# EAGLE schematic LAB_20200315_1_UseFlexSensorToTestServo (EAGLE 9.3.2)
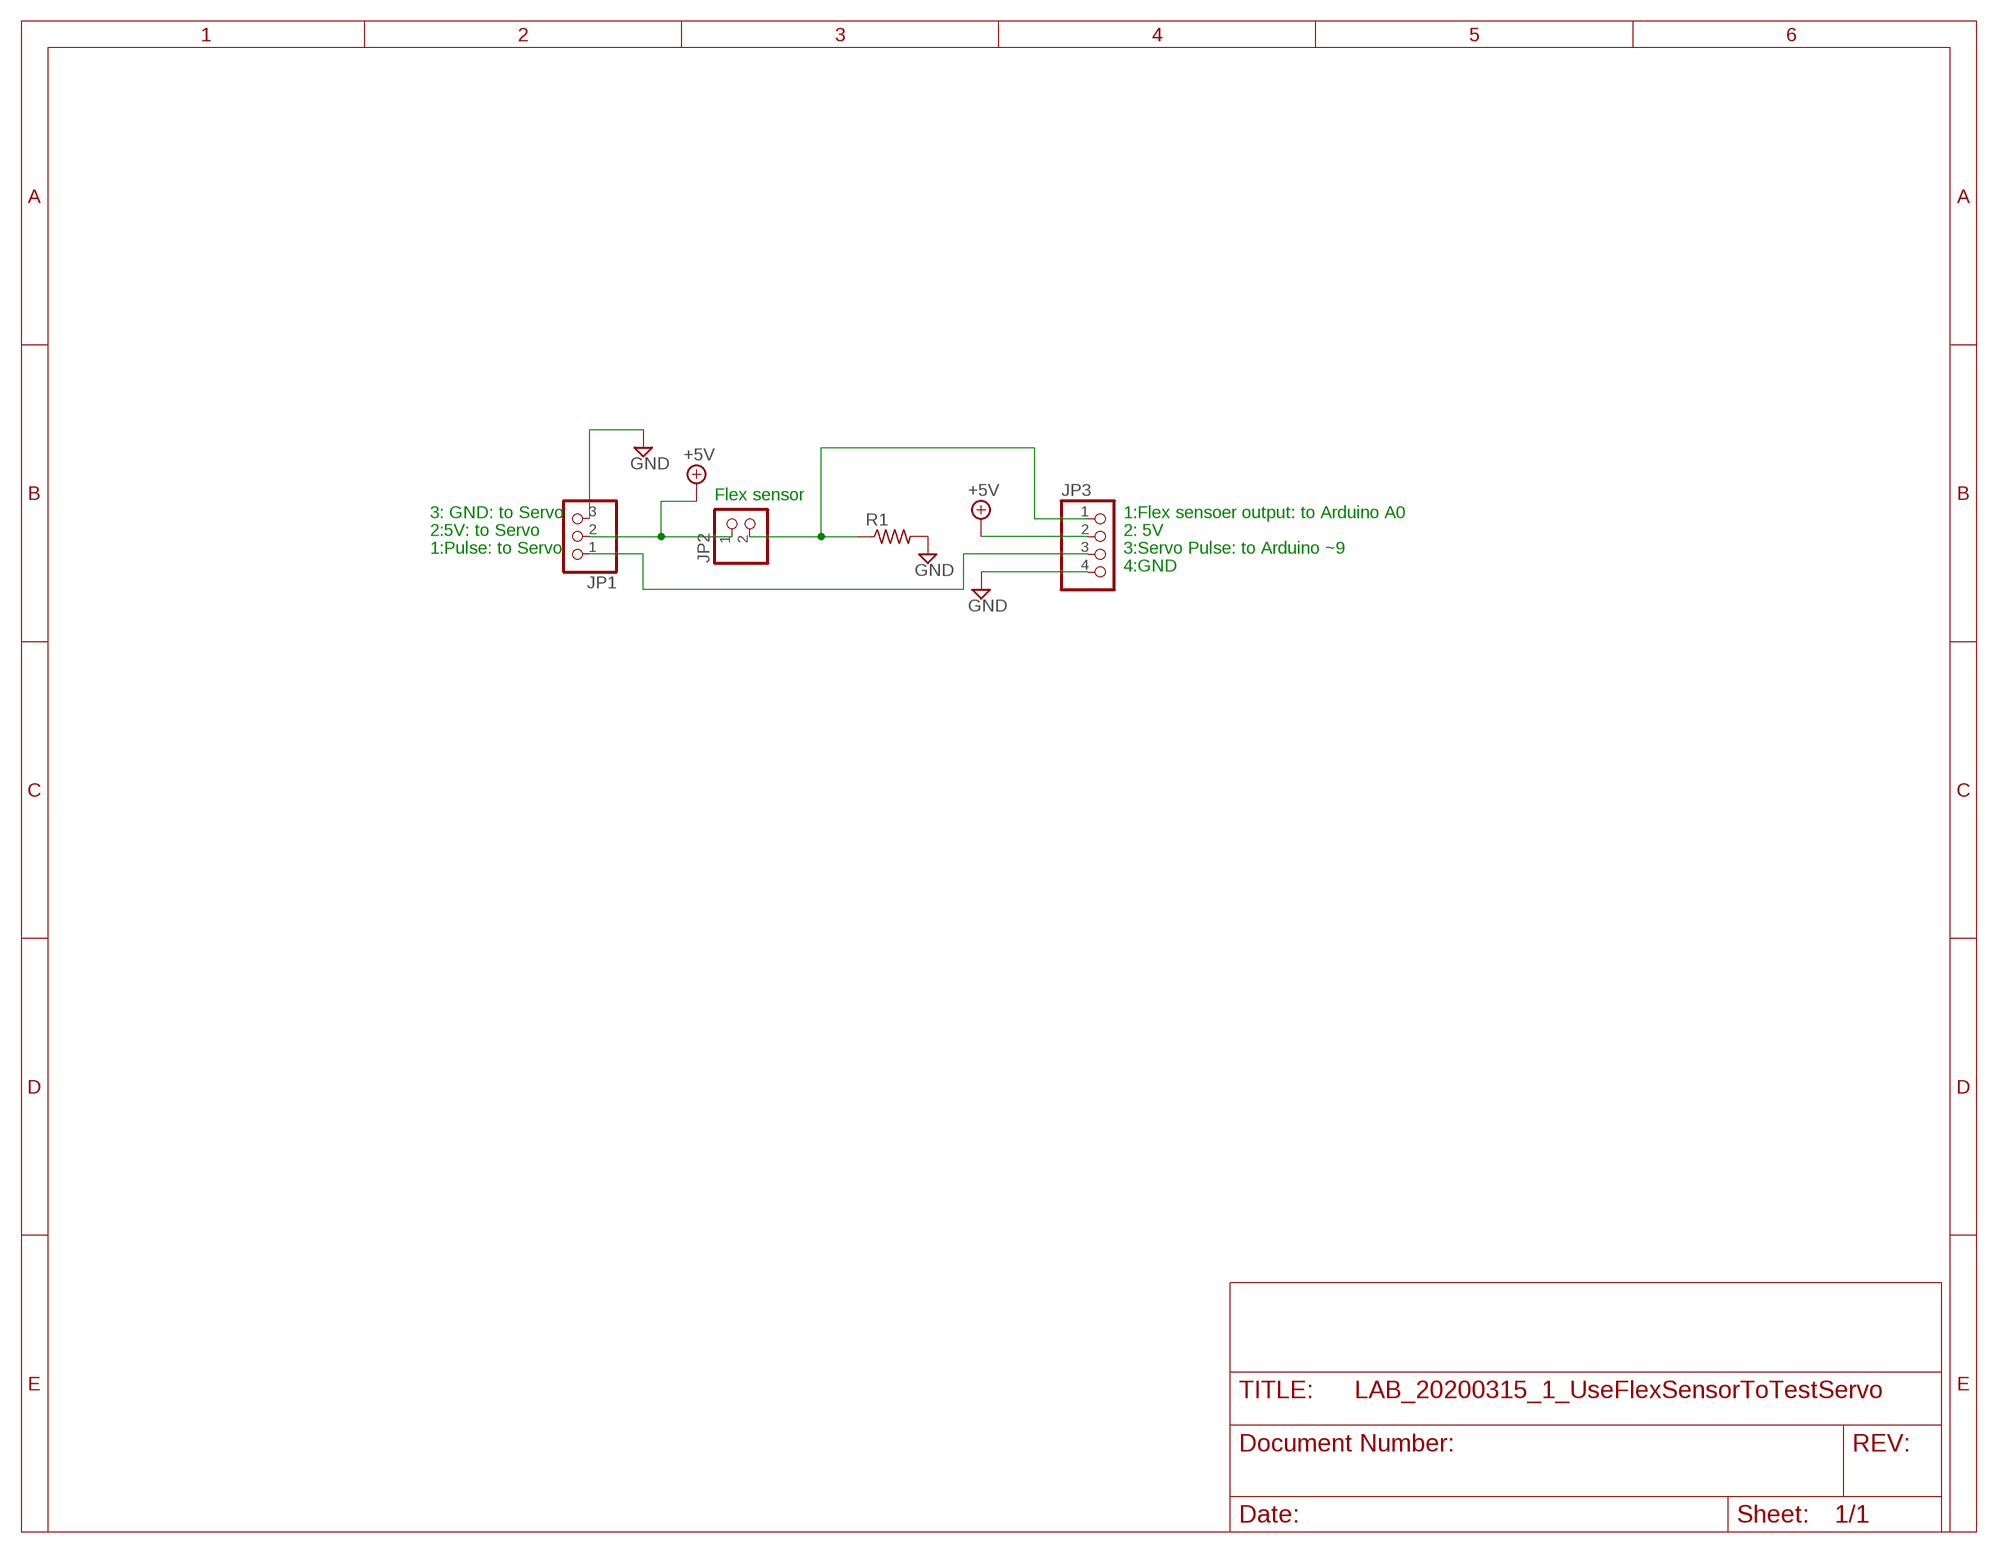
[diagram p0: schematic, sheet 1]

## Parts
JP1  PINHD-1X3  [1X03]
JP2  PINHD-1X2  [1X02]
JP3  PINHD-1X4  [1X04]
R1  R-US_0207/12  [0207/12]

## Nets
+5V: JP1.2 JP2.1 JP3.2
GND: JP1.3 JP3.4 R1.2
N$2: JP2.2 JP3.1 R1.1
N$3: JP1.1 JP3.3

## Notes on the sheet
- Flex sensor
- 3: GND: to Servo | 1:Flex sensoer output: to Arduino A0
- 2:5V: to Servo | 2: 5V
- 1:Pulse: to Servo | 3:Servo Pulse: to Arduino ~9
- 4:GND

## Library data of the parts
JP1 = pinhead:PINHD-1X3: PIN HEADER
JP2 = pinhead:PINHD-1X2: PIN HEADER
JP3 = pinhead:PINHD-1X4: PIN HEADER
R1 = rcl:R-US_: RESISTOR, American symbol; SPICEPREFIX: R